# EAGLE schematic div59_eagle (EAGLE 6.3)
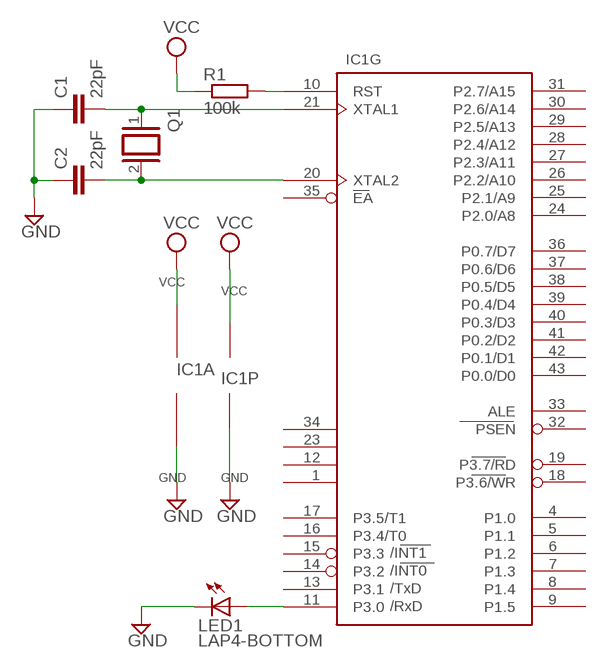
[diagram p0: schematic, sheet 1]

## Parts
C1  22pF  C-EU025-024X044  [C025-024X044]
C2  22pF  C-EU025-024X044  [C025-024X044]
IC1  80C576SMD  [PLCC44]
LED1  LAP4-BOTTOM  [P47F-BOTTOM]
Q1  XTAL/S  [QS]
R1  100k  R-EU_0204/2V  [0204V]

## Nets
GND: C1.1 C2.1 IC1.3(A:AGND) IC1.22(P:GND) LED1.C
N$1: C2.2 IC1.20(G:XTAL2) Q1.2
N$2: C1.2 IC1.21(G:XTAL1) Q1.1
N$3: IC1.10(G:RST) R1.2
N$4: IC1.11(G:P3.0) LED1.A
VCC: IC1.2(A:AVCC) IC1.44(P:VCC) R1.1
Unconnected: IC1.1(G:NC) IC1.4(G:P1.0) IC1.5(G:P1.1) IC1.6(G:P1.2) IC1.7(G:P1.3) IC1.8(G:P1.4) IC1.9(G:P1.5) IC1.12(G:NC) IC1.13(G:P3.1) IC1.14(G:P3.2) IC1.15(G:P3.3) IC1.16(G:P3.4/T0) IC1.17(G:P3.5/T1) IC1.18(G:P3.6/WR) IC1.19(G:P3.7/RD) IC1.23(G:NC) IC1.24(G:P2.0/A8) IC1.25(G:P2.1/A9) IC1.26(G:P2.2/A10) IC1.27(G:P2.3/A11) IC1.28(G:P2.4/A12) IC1.29(G:P2.5/A13) IC1.30(G:P2.6/A14) IC1.31(G:P2.7/A15) IC1.32(G:PSEN) IC1.33(G:ALE) IC1.34(G:NC) IC1.35(G:EA) IC1.36(G:P0.7/D7) IC1.37(G:P0.6/D6) IC1.38(G:P0.5/D5) IC1.39(G:P0.4/D4) IC1.40(G:P0.3/D3) IC1.41(G:P0.2/D2) IC1.42(G:P0.1/D1) IC1.43(G:P0.0/D0)

## Library data of the parts
C1 C2 = rcl:C-EU: CAPACITOR, European symbol
IC1 = micro-philips:80C576: 8051 -compatible 8-bit Microcontroller; OC_FARNELL: unknown; OC_NEWARK: unknown
LED1 = led:*P4: PointLED® Enhanced Thinfilm LED TOP & BOTTOM mount LS P47F, LR P47F, LA P47F, LY P47F, LT P4SG, LB P4SG, LW P4SG Source: http://catalog.osram-os.com .. LA_LR_LS_LY_P47F_Pb_free.pdf
Q1 = special:XTAL/S: CRYSTAL
R1 = rcl:R-EU_: RESISTOR, European symbol